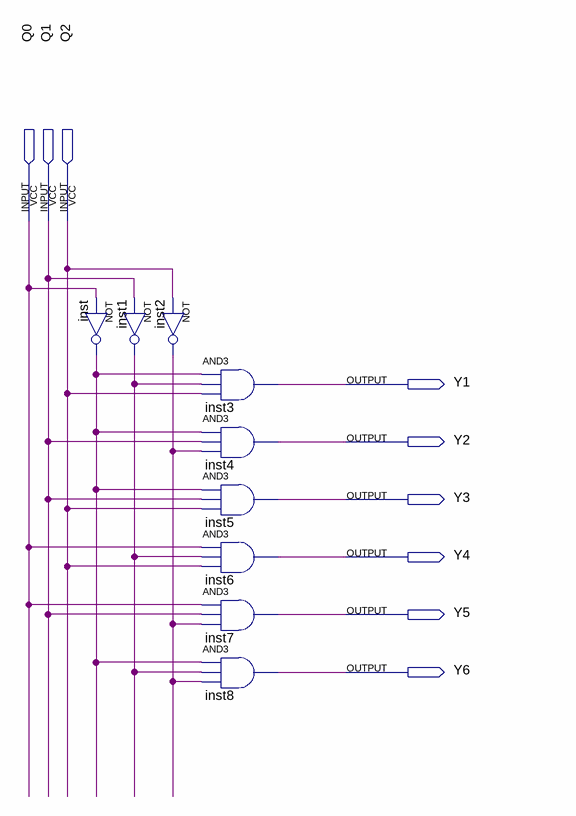
[diagram p0: schematic sheet]
// Quartus schematic Q_TO_Y.bdf as structural Verilog: 9 symbols, 9 pins
module Q_TO_Y (
  input  Q0,
  input  Q1,
  input  Q2,
  output Y1,
  output Y2,
  output Y3,
  output Y4,
  output Y5,
  output Y6
);

  wire inst1_out, inst2_out, inst_out;

  not inst (inst_out, Q0);
  not inst1 (inst1_out, Q1);
  not inst2 (inst2_out, Q2);
  and inst3 (Y1, inst_out, inst1_out, Q2);
  and inst4 (Y2, inst_out, Q1, inst2_out);
  and inst5 (Y3, inst_out, Q1, Q2);
  and inst6 (Y4, Q0, inst1_out, Q2);
  and inst7 (Y5, Q0, Q1, inst2_out);
  and inst8 (Y6, inst_out, inst1_out, inst2_out);
endmodule
